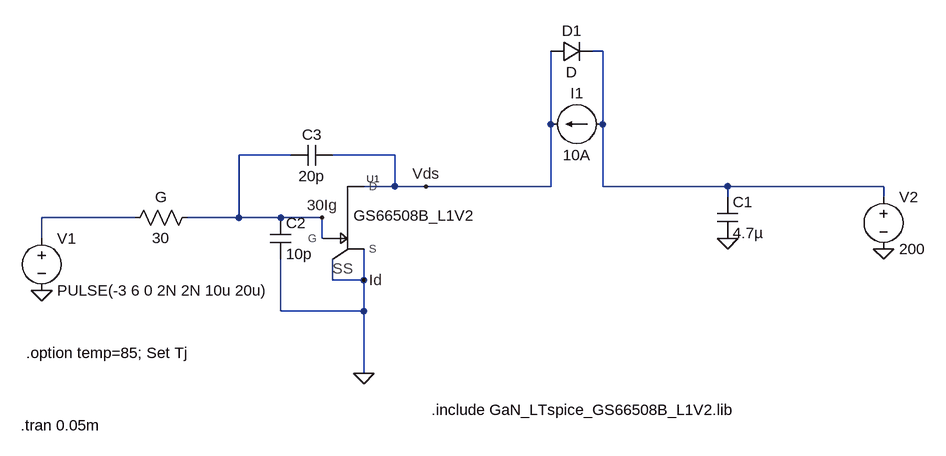
[diagram p0: schematic MillersPlatos.asc]
MillersPlatos.asc, the LTspice schematic file:
Version 4
SHEET 1 936 680
WIRE 432 -352 416 -352
WIRE 352 -240 352 -352
WIRE 432 -240 432 -352
WIRE -48 -192 -128 -192
WIRE 112 -192 16 -192
WIRE 112 -144 112 -192
WIRE 112 -144 64 -144
WIRE 160 -144 112 -144
WIRE 352 -144 352 -240
WIRE 352 -144 160 -144
WIRE 432 -144 432 -240
WIRE 624 -144 432 -144
WIRE 864 -144 624 -144
WIRE 624 -128 624 -144
WIRE 864 -128 864 -144
WIRE -288 -96 -432 -96
WIRE -128 -96 -128 -192
WIRE -128 -96 -208 -96
WIRE -64 -96 -128 -96
WIRE 0 -96 -64 -96
WIRE -432 -64 -432 -96
WIRE 0 -64 0 -96
WIRE 16 0 16 -32
WIRE 64 0 64 -48
WIRE 64 0 16 0
WIRE -64 48 -64 -32
WIRE 64 48 64 0
WIRE 64 48 -64 48
WIRE 64 144 64 48
FLAG -432 16 0
FLAG 64 144 0
FLAG 864 -48 0
FLAG 624 -64 0
FLAG 0 -96 30Ig
FLAG 160 -144 Vds
FLAG 64 0 Id
SYMBOL voltage -432 -80 R0
WINDOW 123 0 0 Left 2
WINDOW 39 0 0 Left 2
SYMATTR InstName V1
SYMATTR Value PULSE(-3 6 0 2N 2N 10u 20u)
SYMBOL res -192 -112 R90
WINDOW 0 0 56 VBottom 2
WINDOW 3 32 56 VTop 2
SYMATTR InstName G
SYMATTR Value 30
SYMBOL GaN_E-HEMT_LT_GS66508B_L1V2 16 -96 R0
SYMATTR InstName U1
SYMBOL current 432 -240 R90
WINDOW 0 -32 40 VBottom 2
WINDOW 3 32 40 VTop 2
WINDOW 123 0 0 Left 2
WINDOW 39 0 0 Left 2
SYMATTR InstName I1
SYMATTR Value 10A
SYMBOL diode 352 -336 R270
WINDOW 0 32 32 VTop 2
WINDOW 3 0 32 VBottom 2
SYMATTR InstName D1
SYMBOL cap 608 -128 R0
SYMATTR InstName C1
SYMATTR Value 4.7µ
SYMBOL voltage 864 -144 R0
WINDOW 123 0 0 Left 2
WINDOW 39 0 0 Left 2
SYMATTR InstName V2
SYMATTR Value 200
SYMBOL cap -80 -96 R0
SYMATTR InstName C2
SYMATTR Value 10p
SYMBOL cap 16 -208 R90
WINDOW 0 0 32 VBottom 2
WINDOW 3 32 32 VTop 2
SYMATTR InstName C3
SYMATTR Value 20p
TEXT 168 200 Left 2 !.include GaN_LTspice_GS66508B_L1V2.lib
TEXT -464 224 Left 2 !.tran 0.05m
TEXT -456 112 Left 2 !.option temp=85; Set Tj

The netlist it stands for:
* MillersPlatos.asc
V1 N002 0 PULSE(-3 6 0 2N 2N 10u 20u)
R§G 30Ig N002 30
XU1 30Ig Vds 0 0 GS66508B_L1V2  ; pins G D S SS
I1 N001 Vds 10A
D1 Vds N001 D
C1 N001 0 4.7µ
V2 N001 0 200
C2 30Ig 0 10p
C3 Vds 30Ig 20p
.model D D
.lib standard.dio
.include GaN_LTspice_GS66508B_L1V2.lib
.tran 0.05m
.option temp=85; Set Tj
.lib GaN_LTspice_GS66508B_L1V2.lib
.backanno
.end